# EAGLE design EPBooster (EAGLE 6.5.0)
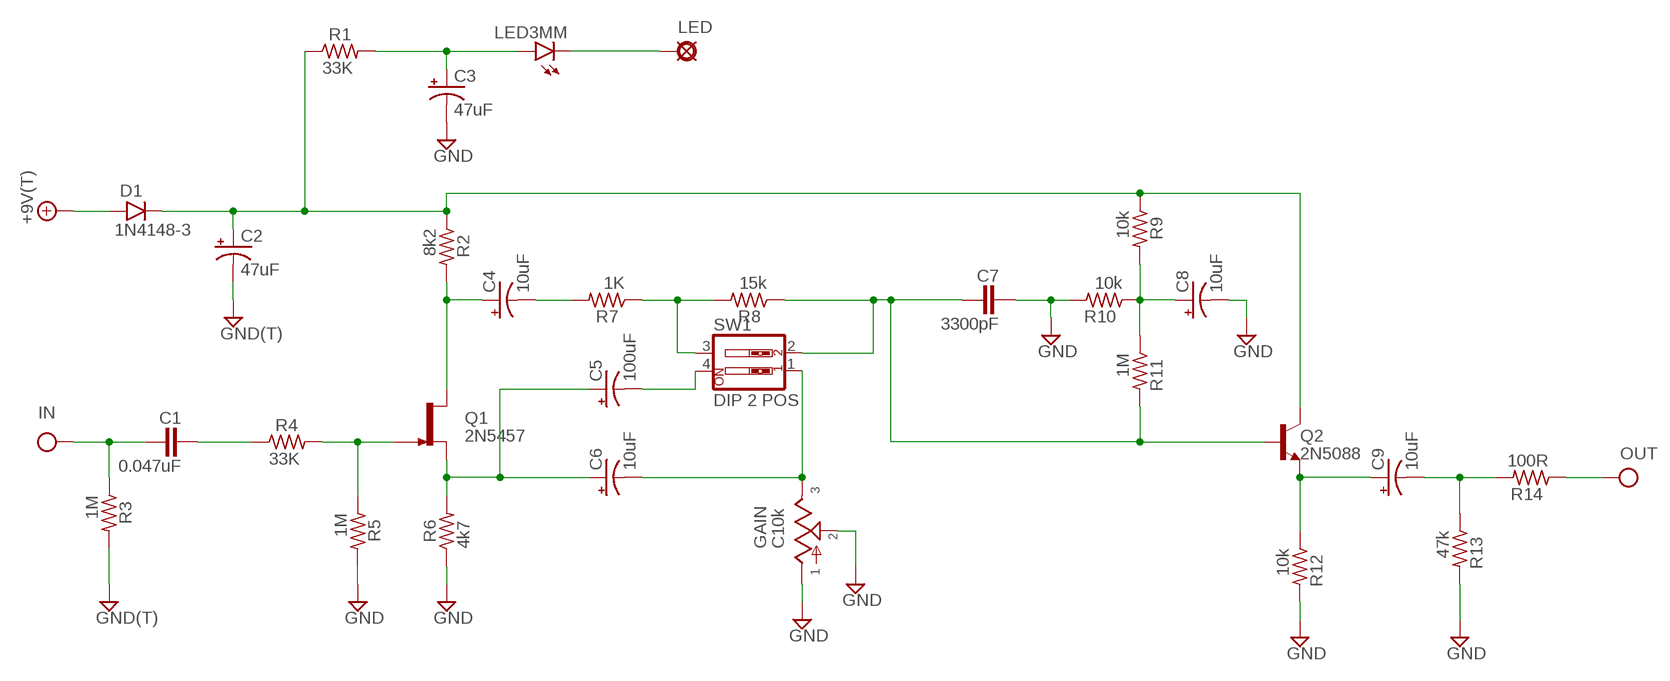
[diagram p0: schematic, sheet 1]

## Parts
+9/18V  +9V(T)  [SQUARE]
C1  0.047uF  072X0252  [072X025]
C2  47uF  0501  [050_020_1]
C3  47uF  0501  [050_020_1]
C4  10uF  0501  [050_020_1]
C5  100uF  0631  [063_025]
C6  10uF  0501  [050_020_1]
C7  3300pF  072X0252  [072X025]
C8  10uF  0501  [050_020_1]
C9  10uF  0501  [050_020_1]
D1  1N4148-3  [DO35-3]
G  GND(T)  [SQUARE]
GAIN  C10k  POT  [POT]
GND  GND(T)  [SQUARE]
IN  IN(T)  [SQUARE]
LED  PAD  [SQUARE]
LED3MM  3MM  LED3MM  [LED3MM]
OUT  OUT(T)  [SQUARE]
Q1  2N5457  [TO92-]
Q2  2N5088  [TO92-]
R1  33K  3MM.2  [R0204/2]
R2  8k2  3MM.2  [R0204/2]
R3  1M  3MM.2  [R0204/2]
R4  33K  3MM.2  [R0204/2]
R5  1M  3MM.2  [R0204/2]
R6  4k7  3MM.2  [R0204/2]
R7  1K  3MM.2  [R0204/2]
R8  15k  3MM.2  [R0204/2]
R9  10k  3MM.2  [R0204/2]
R10  10k  3MM.2  [R0204/2]
R11  1M  3MM.2  [R0204/2]
R12  10k  3MM.2  [R0204/2]
R13  47k  3MM.2  [R0204/2]
R14  100R  3MM.2  [R0204/2]
SW1  DIP 2 POS  SW_DIP-2  [EDG-02]

## Nets
+9V: +9/18V.1(+9V) D1.A
GND: C2.- C3.- C7.2 C8.- G.1(GND) GAIN.1 GAIN.2 GND.1(GND) R3.2 R5.2 R6.1 R10.2 R12.2 R13.2
IN: C1.1 IN.1(IN) R3.1
N$1: C3.+ LED3MM.A R1.2
N$2: C2.+ D1.C Q2.1(C) R1.1 R2.1 R9.1
N$3: C1.2 R4.1
N$4: Q1.1(G) R4.2 R5.1
N$5: C4.+ Q1.3(D) R2.2
N$6: C5.+ C6.+ Q1.2(S) R6.2
N$7: C4.- R7.2
N$8: C5.- SW1.4
N$9: C9.+ Q2.3(E) R12.1
N$10: C6.- GAIN.3 SW1.1
N$11: R7.1 R8.2 SW1.3
N$12: C9.- R13.1 R14.2
N$13: C8.+ R9.2 R10.1 R11.1
N$14: LED3MM.K(C) LED.1(PAD)
N$15: C7.1 Q2.2(B) R8.1 R11.2 SW1.2
OUT: OUT.1(OUT) R14.1

## Library data of the parts
+9/18V = mb_supply:+9V(T): +9V Voltage Supply use this to hook up +9v throughout a schematic instead of running wire automatically labels the net "+9v" adds a hookup pad to the circuit board
C1 C7 = mb_caps-box:072X025: 1000pF - 0.47uF WIMA MKP2 63, 100V: 1000pF - 0.015uF; MKS2 50V: 0.33 - 0.47uF; 63V: 1000pF - 0.22uF;
C2-C4 C6 C8 C9 = mb_caps-electro:050: 0.22 - 100uF Xicon values at Mouser.com: 10V: 10 - 100uF; 16V: 2.2 - 47uF; 25V: 0.47 - 47uF; 50V: 0.22 - 22uF
C5 = mb_caps-electro:063: 33 - 220uF Xicon values at Mouser.com 10V: 220uF; 16V: 100uF; 25V: 100uF; 50V: 33uF
D1 = mb_diodes:1N4148: Fast Switching Diode DO-35 glass case a.k.a. 1N914
G GND = mb_supply:GND(T): Ground use this to hook up ground (GND) throughout a schematic instead of running wire automatically labels the net "GND" adds a hookup pad to the circuit board (you can use several)
GAIN = mb_pots:POT: Potentiometers the arrow indicates the clockwise motion of th wiper (lug 2) fully counter clockwise there is no resistance between lugs 1 and 2 fully clockwise the resistance between lugs 1 and 2 is the value of the pot
IN = mb_supply:IN(T): Input obsolete: use Pad instead and label net shematic input label with circuit board terminal/pad generally used only once on a schematic (because this device labels the net "IN" in the same way as a voltage supply or ground net)
LED = mb_supply:PAD: PAD use this package for pads with any purpose, including input, output, send or return various pad shapes: round, square, octogonal, long, and long offset
LED3MM = mb_diodes:LED
OUT = mb_supply:OUT(T): Output obsolete: use Pad instead and label net output label with circuit board terminal/pad usually appears only once on a schematic
Q1 = mb_trans:2N5457: N-CHANNEL JFET
Q2 = mb_trans:2N5088: NPN Transistor
R1-R14 = mb_resistors:3MM: 3mm Resistors Leads spaced 1-6 holes apart for 0.1" perfboard. Suitable for 1/8 watt resistors.
SW1 = mb_dip switch:SW_DIP-2: DIP SWITCH

## Board
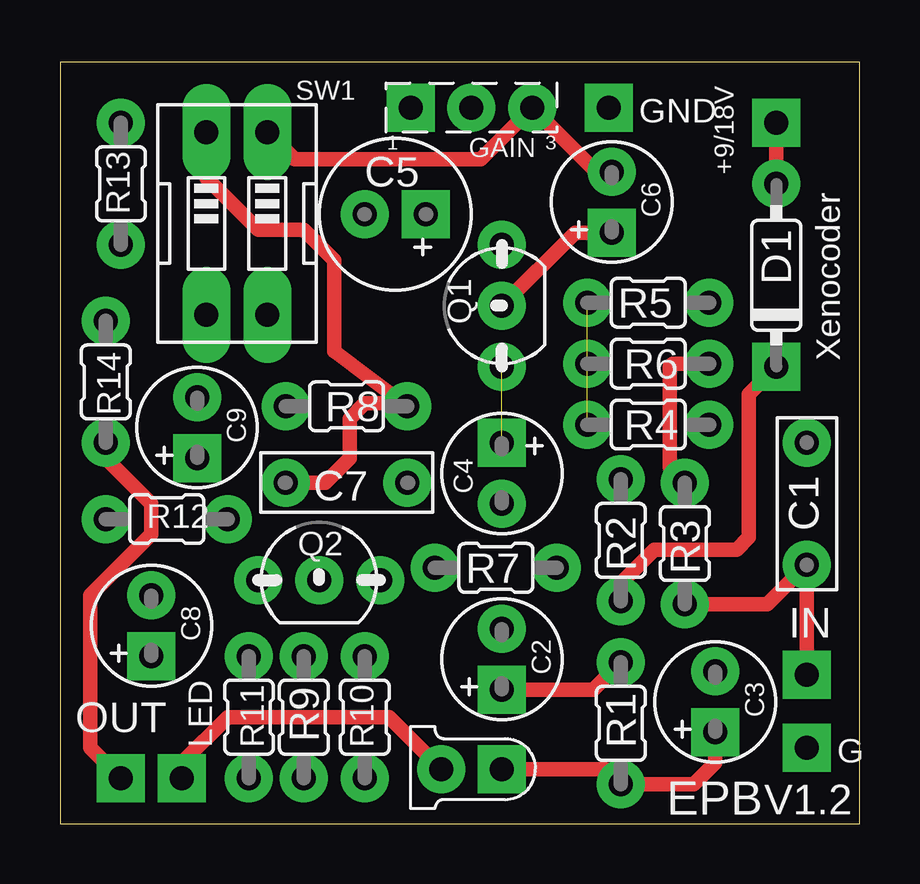
[diagram p1: board, top side]
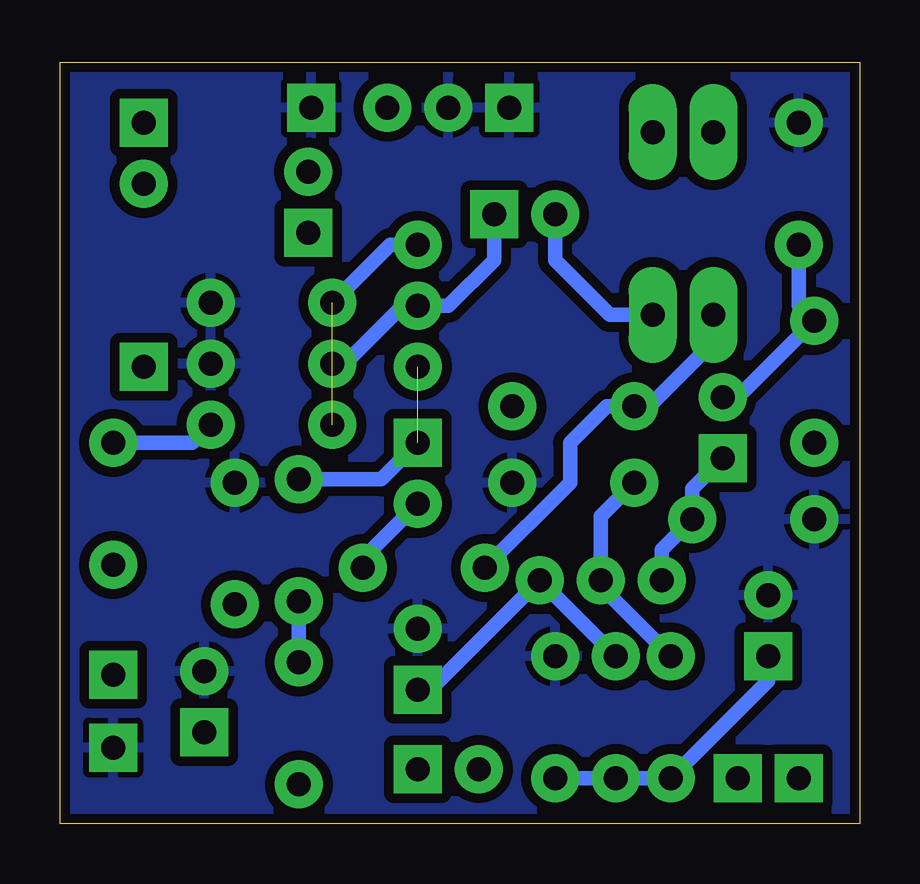
[diagram p2: board, bottom side, seen from below]

Size 33.33 x 31.74 mm. Coordinates in mm from the lower left corner, seen from the top.
Outline: 0,0 33.33,0 33.33,31.74 0,31.74 0,0
Copper layers (1*16): Top 0.0356mm / dielectric 1.5011mm / Bottom 0.0356mm
Design rules "default": minimum track width 6mil, minimum drill 13mil, track to track 6mil, track to pad 6mil, pad to pad 6mil, via to via 6mil, smd to smd 6mil, copper to edge 15mil, drill to drill 6mil, minimum pad ring 7mil, minimum via ring 7mil, stop-mask expansion 3mil, vias tented up to drill 0mil, thermal gap 10mil

### Footprints (pad centres in the part's own frame; a part is rotated, then mirrored left to right if it is on the bottom)
SQUARE = drill 1 pad 2 square: 1 0,0
072X025 = drill 1 pad 2: 1 -2.54,0; 2 2.54,0
050_020_1 = drill 1 pad 2 square: + -1.27,0 | drill 1 pad 2: - 1.27,0
063_025 = drill 1 pad 2 square: + -1.27,0 | drill 1 pad 2: - 1.27,0
DO35-3 = drill 1 pad 2: A 3.81,0 | drill 1 pad 2 square: C -3.81,0
POT = drill 1 pad 2 square: 1 2.54,0 | drill 1 pad 2: 2 0,0; 3 -2.54,0
LED3MM = drill 1 pad 2 square: A -1.27,0 | drill 1 pad 2: K 1.27,0
TO92- = drill 1 pad 2: 1 2.54,0; 2 0,0; 3 -2.54,0
R0204/2 = drill 1 pad 2: 1 -2.54,0; 2 2.54,0
EDG-02 = drill 1 pad 2 long: 1 -1.27,-3.81; 2 1.27,-3.81; 3 1.27,3.81; 4 -1.27,3.81

### Placement (x,y rotation side)
+9/18V  29.84,29.21 0 top
C1  31.11,13.34 90 top
C2  18.41,6.86 90 top
C3  27.3,5.08 90 top
C4  18.41,14.61 270 top
C5  13.97,25.4 180 top
C6  22.99,25.91 90 top
C7  11.94,14.22 0 top
C8  3.81,8.26 90 top
C9  5.71,16.51 90 top
D1  29.84,22.86 90 top
G  31.11,3.17 0 top
GAIN  17.14,29.84 180 top
GND  22.86,29.84 0 top
IN  31.11,6.22 0 top
LED  5.08,1.91 0 top
LED3MM  17.14,2.29 180 top
OUT  2.54,1.91 0 top
Q1  18.41,21.59 90 top
Q2  10.79,10.16 0 top
R1  23.37,4.19 270 top
R2  23.37,11.81 90 top
R3  26.04,11.68 90 top
R4  24.51,16.64 180 top
R5  24.51,21.72 0 top
R6  24.51,19.18 180 top
R7  18.16,10.67 0 top
R8  11.94,17.4 180 top
R9  10.16,4.45 270 top
R10  12.7,4.45 90 top
R11  7.87,4.45 90 top
R12  4.45,12.7 180 top
R13  2.54,26.67 90 top
R14  1.91,18.41 90 top
SW1  7.37,25.02 180 top

### Tracks (layer width: path | path; a pad name or v marks a point on that pad's centre or on a via)
+9V
  Top 0.61: +9/18V.1 D1.A
GND
  Top 0.61: R3.2 25.4,14.86 25.4,19.05 25.53,19.18 R6.1
  pour Bottom (isolate 0.406): 0,31.75 33.02,31.75 33.02,0 0,0
IN
  Top 0.61: IN.1 C1.1 29.46,9.14 R3.1
N$1
  Top 0.61: LED3MM.A 22.73,2.29 R1.2 26.42,1.65 27.3,2.54 C3.+
N$2
  Top 0.61: D1.C 28.7,17.91 28.7,11.94 28.19,11.43 24.77,11.43 23.5,10.16 23.5,9.4 R2.1 | R1.1 22.23,5.59 C2.+
  Bottom 0.61: R9.1 Q2.1 17.91,5.59 C2.+ | R1.1 R2.1
N$3
  Bottom 0.61: R4.1 27.81,15.88 C1.2
N$4  (1 unrouted)
  Bottom 0.61: R5.1 19.56,24.13 Q1.1
N$5  (1 unrouted)
  Bottom 0.61: C4.+ 19.94,14.35 R2.2
N$6
  Top 0.61: C6.+ 21.46,24.64 Q1.2
  Bottom 0.61: C5.+ 15.24,23.5 17.14,21.59 Q1.2 19.05,21.59 21.46,19.18 R6.2
N$7
  Bottom 0.61: R7.2 20.7,11.05 C4.-
N$8
  Bottom 0.61: SW1.4 10.41,21.21 12.7,23.5 C5.-
N$9
  Bottom 0.61: Q2.3 8.26,11.43 R12.1 6.99,13.97 C9.+
N$10
  Top 0.61: C6.- 22.23,27.3 GAIN.3 17.53,27.69 9.78,27.69 SW1.1
N$11
  Bottom 0.61: SW1.3 6.1,20.07 8.76,17.4 R8.2 10.54,17.4 12.06,15.88 12.06,14.22 R7.1
N$12
  Bottom 0.61: R13.1 2.54,21.59 R14.2 5.08,17.78 C9.-
N$13
  Bottom 0.61: C8.+ 3.81,5.97 R11.1 R9.2 R10.1
N$14
  Top 0.61: LED3MM.K 13.72,4.45 6.99,4.45 5.08,2.54 LED.1
N$15
  Top 0.61: SW1.2 6.1,26.92 8.26,24.77 10.16,24.77 11.43,23.5 11.43,19.68 R8.1 14.35,17.53 12.7,17.53 12.06,16.89 12.06,15.24 11.05,14.22 C7.1
  Bottom 0.61: R11.2 10.79,9.91 Q2.2 10.79,12.83 C7.1
OUT
  Top 0.61: R14.1 1.91,15.24 3.81,13.34 3.81,12.06 1.27,9.53 1.27,3.17 OUT.1

### Text on the board
tPlace: Xenocoder | EPB | V1.2